# EAGLE schematic schemat_eagle (EAGLE 6.5.0)
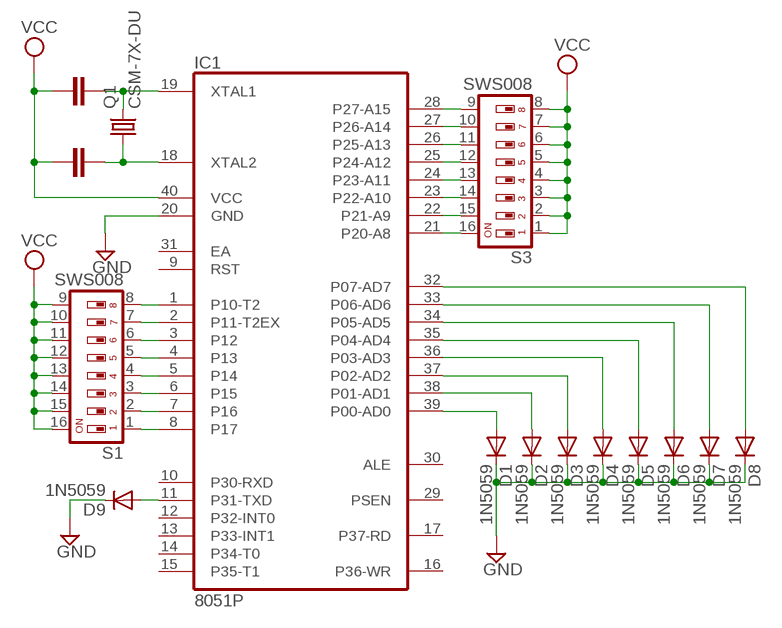
[diagram p0: schematic, sheet 1]

## Parts
D1  1N5059  [DO204-10]
D2  1N5059  [DO204-10]
D3  1N5059  [DO204-10]
D4  1N5059  [DO204-10]
D5  1N5059  [DO204-10]
D6  1N5059  [DO204-10]
D7  1N5059  [DO204-10]
D8  1N5059  [DO204-10]
D9  1N5059  [DO204-10]
IC1  8051P  [DIL40]
Q1  CSM-7X-DU  [CSM-7X-DU]
S1  SWS008  [SMS-008]
S3  SWS008  [SMS-008]

## Nets
GND: D1.C D2.C D3.C D4.C D5.C D6.C D7.C D8.C D9.C IC1.20(GND)
N$1: IC1.8(P17) S1.1
N$2: IC1.7(P16) S1.2
N$3: IC1.6(P15) S1.3
N$4: IC1.5(P14) S1.4
N$5: IC1.4(P13) S1.5
N$6: IC1.3(P12) S1.6
N$7: IC1.2(P11-T2EX) S1.7
N$8: IC1.1(P10-T2) S1.8
N$9: D8.A IC1.32(P07-AD7)
N$10: D7.A IC1.33(P06-AD6)
N$11: D6.A IC1.34(P05-AD5)
N$12: D5.A IC1.35(P04-AD4)
N$13: D4.A IC1.36(P03-AD3)
N$14: D3.A IC1.37(P02-AD2)
N$15: D2.A IC1.38(P01-AD1)
N$16: D1.A IC1.39(P00-AD0)
N$17: IC1.28(P27-A15) S3.9
N$18: IC1.27(P26-A14) S3.10
N$19: IC1.26(P25-A13) S3.11
N$20: IC1.25(P24-A12) S3.12
N$21: IC1.24(P23-A11) S3.13
N$22: IC1.23(P22-A10) S3.14
N$23: IC1.22(P21-A9) S3.15
N$24: IC1.21(P20-A8) S3.16
N$25: D9.A IC1.11(P31-TXD)
N$26: IC1.19(XTAL1) Q1.2
N$27: IC1.18(XTAL2) Q1.1
VCC: IC1.40(VCC) S1.9 S1.10 S1.11 S1.12 S1.13 S1.14 S1.15 S1.16 S3.1 S3.2 S3.3 S3.4 S3.5 S3.6 S3.7 S3.8
Unconnected: IC1.9(RST) IC1.10(P30-RXD) IC1.12(P32-INT0) IC1.13(P33-INT1) IC1.14(P34-T0) IC1.15(P35-T1) IC1.16(P36-WR) IC1.17(P37-RD) IC1.29(PSEN) IC1.30(ALE) IC1.31(EA)

## Library data of the parts
D1-D9 = diode:1N5059: DIODE controlled avalanche rectifier
IC1 = micro-intel:8051: (CHMOS) SINGLE-CHIP 8-BIT MICROCONTROLLER 80C31BH / 80C51 BH / 87C51 MCS 51 Source: http://apps.intel.com .. 27041907.pdf; OC_FARNELL: unknown; OC_NEWARK: unknown
Q1 = crystal:CSM-7X-DU: SMD CRYSTAL Source: www.ecsxtal.com .. Crystal 3.6864MHz CSM_7X_DU.PDF; OC_FARNELL: unknown; OC_NEWARK: unknown
S1 S3 = smd-special:SWS008: SMD Dip Switch 8 pol.